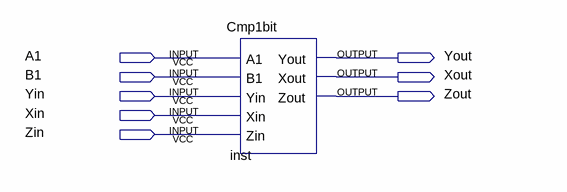
[diagram p0: schematic sheet]
// Quartus schematic CmpDemo.bdf as structural Verilog: 1 symbols, 8 pins
module CmpDemo (
  input  A1,
  input  B1,
  input  Yin,
  input  Xin,
  input  Zin,
  output Yout,
  output Xout,
  output Zout
);

  Cmp1bit inst (.A1(A1), .B1(B1), .Yin(Yin), .Xin(Xin), .Zin(Zin), .Yout(Yout), .Xout(Xout), .Zout(Zout));
endmodule
